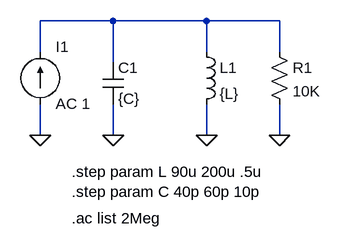
[diagram p0: schematic Nested.asc]
Nested.asc, the LTspice schematic file:
Version 4
SHEET 1 880 680
WIRE 80 320 80 272
WIRE 80 208 80 144
WIRE 80 144 224 144
WIRE 224 144 224 192
WIRE 224 272 224 320
WIRE -32 320 -32 272
WIRE -32 192 -32 144
WIRE -32 144 80 144
WIRE 224 144 336 144
WIRE 336 144 336 192
WIRE 336 272 336 320
FLAG 224 320 0
FLAG 80 320 0
FLAG -32 320 0
FLAG 336 320 0
SYMBOL ind 208 176 R0
SYMATTR InstName L1
SYMATTR Value {L}
SYMBOL cap 64 208 R0
SYMATTR InstName C1
SYMATTR Value {C}
SYMBOL current -32 272 M180
WINDOW 0 24 88 Left 0
WINDOW 3 24 0 Left 0
SYMATTR InstName I1
SYMATTR Value AC 1
SYMBOL res 320 176 R0
SYMATTR InstName R1
SYMATTR Value 10K
TEXT 16 376 Left 0 !.step param L 90u 200u .5u\n.step param C 40p 60p 10p
TEXT 16 448 Left 0 !.ac list 2Meg

The netlist it stands for:
* Nested.asc
L1 N001 0 {L}
C1 N001 0 {C}
I1 0 N001 AC 1
R1 N001 0 10K
.step param L 90u 200u .5u
.step param C 40p 60p 10p
.ac list 2Meg
.backanno
.end